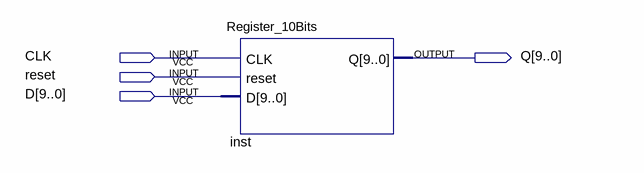
[diagram p0: schematic sheet]
// Quartus schematic testRegister_10Bits.bdf as structural Verilog: 1 symbols, 4 pins
module testRegister_10Bits (
  input  CLK,
  input  reset,
  input  [9:0] D,
  output [9:0] Q
);

  Register_10Bits inst (.CLK(CLK), .reset(reset), .D(D), .Q(Q));
endmodule
